# EAGLE schematic Tractive System (EAGLE 9.3.0)
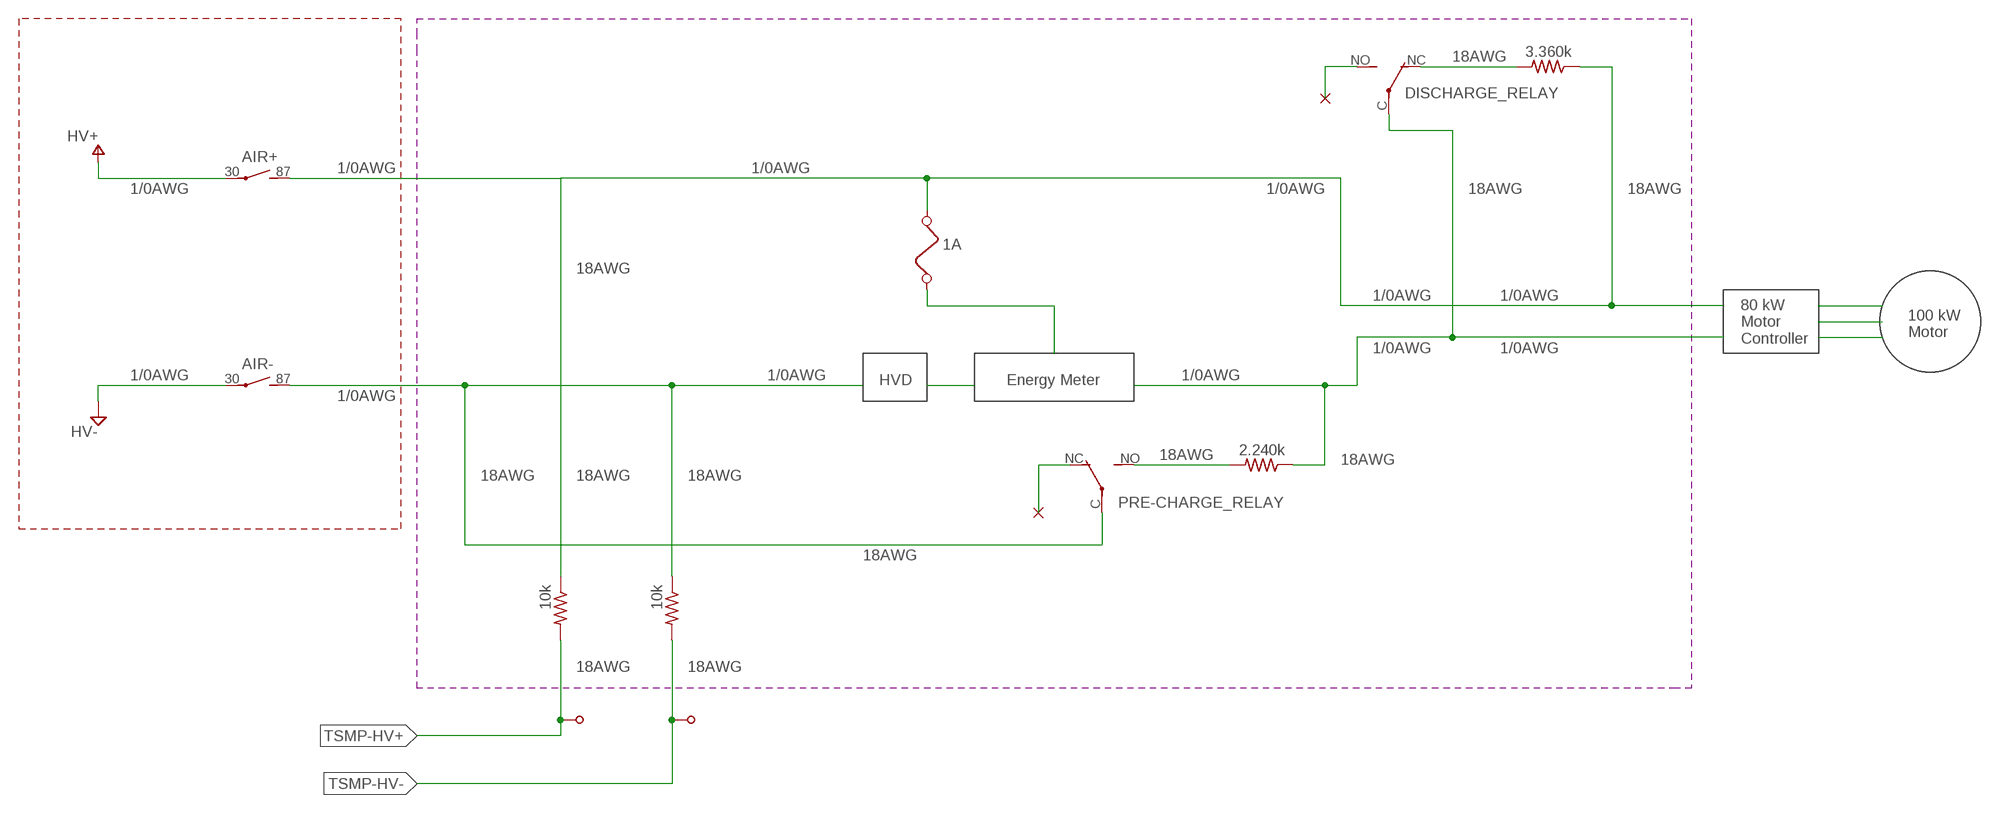
[diagram p0: schematic, sheet 1]

## Parts
AIR+  CB1A-P-12V  [CB1]
AIR-  CB1A-P-12V  [CB1]
DISCHARGE_RELAY  CT112  [CT-SLIM]
F1  1A  FUSE  [FUSE]
PRE-CHARGE_RELAY  CT112  [CT-SLIM]
R1  3.360k  R-US_R0805  [R0805]
R2  10k  R-US_R0805  [R0805]
R3  2.240k  R-US_R0805  [R0805]
R4  10k  R-US_R0805  [R0805]
U$1  BANANA-JACK  [BANANA-PRINT]
U$3  BANANA-JACK  [BANANA-PRINT]

## Nets
GND: AIR-.30(2:P) ; supply symbol labelled HV-
N$1: PRE-CHARGE_RELAY.NO(2:S) R3.2
N$5: F1.1
N$7: AIR-.87(2:S) PRE-CHARGE_RELAY.C(2:P) R4.1
N$8: DISCHARGE_RELAY.NC(2:O) R1.2
N$11: DISCHARGE_RELAY.NO(2:S)
N$12: DISCHARGE_RELAY.C(2:P) R3.1
N$13: AIR+.87(2:S) F1.2 R1.1 R2.1
N$15: PRE-CHARGE_RELAY.NC(2:O)
TSMP-HV+: R2.2 U$1.P$1(PIN)
TSMP-HV-: R4.2 U$3.P$1(PIN)
V+: AIR+.30(2:P) ; supply symbol labelled HV+
Unconnected: AIR+.85 AIR+.86 AIR-.85 AIR-.86 DISCHARGE_RELAY.1 DISCHARGE_RELAY.2 PRE-CHARGE_RELAY.1 PRE-CHARGE_RELAY.2

## Notes on the sheet
- 18AWG
- 1/0AWG | 1/0AWG
- 1/0AWG | 1/0AWG | 18AWG | 18AWG
- 18AWG
- 1/0AWG | 1/0AWG
- 100 kW
  Motor
- 80 kW
  Motor
  Controller
- 1/0AWG | 1/0AWG
- 1/0AWG | 1/0AWG | 1/0AWG
- HVD | Energy Meter
- 1/0AWG
- 18AWG
- 18AWG
- 18AWG | 18AWG | 18AWG
- 18AWG
- 18AWG | 18AWG

## Library data of the parts
AIR+ AIR- = relay:CB*: HIGH POWER AUTOMOTIVE RELAY Form A NAiS Source: http://www.mew-europe.com/.. en_ds_61202_0000.pdf; MF: AROMAT/ MATSUSHITA; MPN: CB1A-P-12V; OC_FARNELL: 1270582; OC_NEWARK: 50B849
DISCHARGE_RELAY PRE-CHARGE_RELAY = relay:CT112: ULTRA SMALL AUTOMOTIVE RELAY NAiS Slim 1c type en_ds_61205_0000.pdf; OC_FARNELL: unknown; OC_NEWARK: unknown
F1 = special:FUSE: FUSE 5 x 20 mm
R1-R4 = rcl:R-US_: RESISTOR, American symbol; SPICEPREFIX: R
U$1 U$3 = con-banana:BANANA-JACK